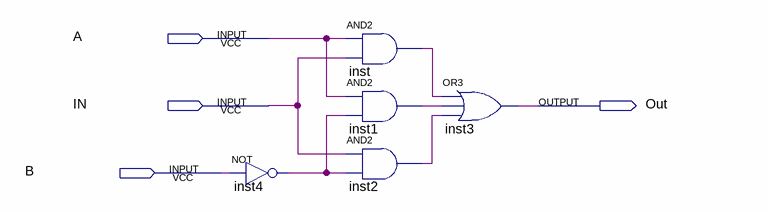
[diagram p0: schematic sheet]
// Quartus schematic A_Maior_Bbit.bdf as structural Verilog: 5 symbols, 4 pins
module A_Maior_Bbit (
  input  A,
  input  IN,
  input  B,
  output Out
);

  wire inst1_out, inst2_out, inst4_out, inst_out;

  not inst4 (inst4_out, B);
  and inst (inst_out, A, IN);
  and inst1 (inst1_out, A, inst4_out);
  and inst2 (inst2_out, IN, inst4_out);
  or inst3 (Out, inst_out, inst1_out, inst2_out);
endmodule
